# Altium project Project Kraken (The Ultimate ESP32-S3 dev board).PrjPcb (part 4 of 5)

## Sheet CAN.SchDoc
size A3; SheetNumber: 8; SheetTotal: 9
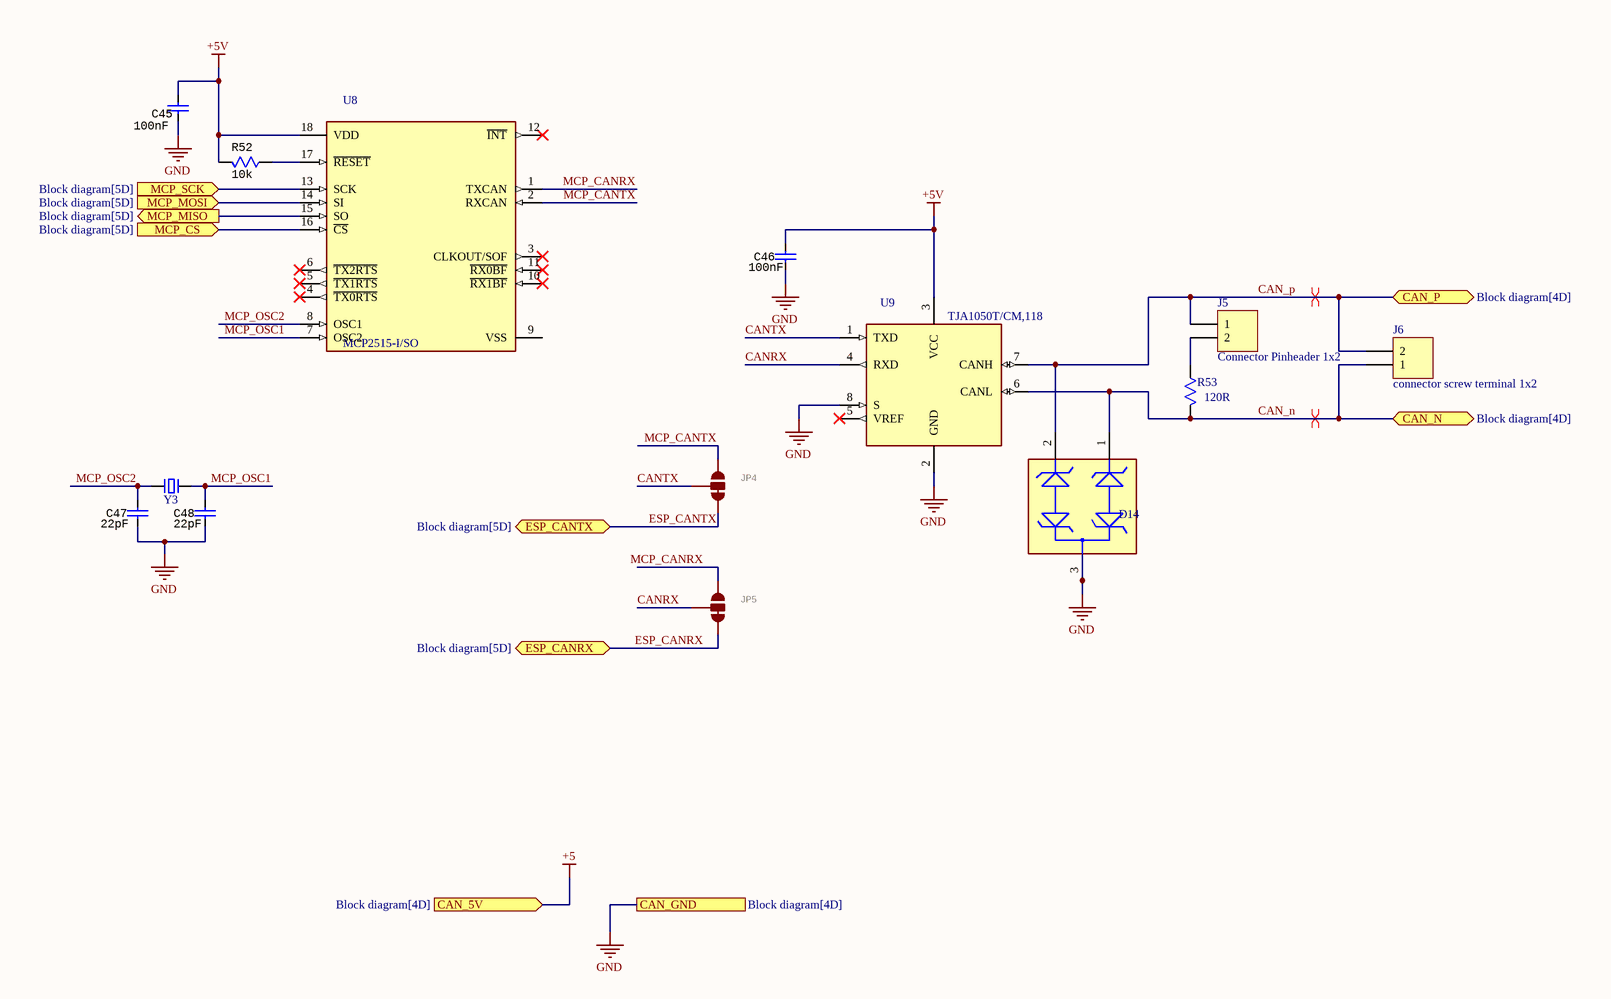
[diagram p6: CAN.SchDoc]

### Parts
C45  100nF  [CAP Ceramic SMD 0603]
C46  100nF  [CAP Ceramic SMD 0603]
C47  22pF  [CAP Ceramic SMD 0603]
C48  22pF  [CAP Ceramic SMD 0603]
D14  CPDT_12V  [SOT23]  (value not drawn)
J5  Connector Pinheader 1x2  [Header 1.27X2]
J6  connector screw terminal 1x2  [Connector screw terminal Block TH 1x2 3.5]
JP4  JUMPER-SMT_3_1-NC_TRACE_SILK  [SMT-JUMPER_3_1-NC_TRACE_SILK]  (value not drawn)
JP5  JUMPER-SMT_3_1-NC_TRACE_SILK  [SMT-JUMPER_3_1-NC_TRACE_SILK]  (value not drawn)
R52  value 10k  [RES SMD 0603]  (hidden comment: 10kR)
R53  120R  [RES SMD 0603]
U8  MCP2515-I/SO  [MCP2515]
U9  TJA1050T/CM,118  [TJA1050T/CM,118]
Y3  X49SD8MSD2SC  [Crystal TH 2-PIN HC-49S]  (value not drawn)

### Ports
CAN_5V (in, see Block diagram[4D]), CAN_GND (see Block diagram[4D]), CAN_N (bidir, see Block diagram[4D]), CAN_P (bidir, see Block diagram[4D]), ESP_CANRX (bidir, see Block diagram[5D]), ESP_CANTX (bidir, see Block diagram[5D]), MCP_CS (in, see Block diagram[5D]), MCP_MISO (out, see Block diagram[5D]), MCP_MOSI (in, see Block diagram[5D]), MCP_SCK (in, see Block diagram[5D])

### Nets
+5: C45.2 C46.2 R52.2 U8.18(VDD) U9.3(VCC) ; port CAN_5V  [also labelled +5V]
GND: C45.1 C46.1 C47.1 C48.1 D14.3 U9.2(GND) U9.8(S) ; port CAN_GND
CAN_n: D14.1 J6.1 R53.2 U9.6(CANL) ; port CAN_N
CAN_p: D14.2 J5.1 J6.2 U9.7(CANH) ; port CAN_P
CANRX: JP5.2 U9.4(RXD)
CANTX: JP4.2 U9.1(TXD)
ESP_CANRX: JP5.3 ; port ESP_CANRX  [project net CAN_RX]
ESP_CANTX: JP4.3 ; port ESP_CANTX  [project net CAN_TX]
ETH_MISO: U8.15(SO) ; port MCP_MISO
ETH_MOSI: U8.14(SI) ; port MCP_MOSI
ETH_SCLK: U8.13(SCK) ; port MCP_SCK
IO46: U8.16(~{CS}) ; port MCP_CS
MCP_CANRX: JP5.1 U8.1(TXCAN)
MCP_CANTX: JP4.1 U8.2(RXCAN)
MCP_OSC1: C48.2 U8.7(OSC2) Y3.1
MCP_OSC2: C47.2 U8.8(OSC1) Y3.2
NetJ5_2: J5.2 R53.1
NetR52_1: R52.1 U8.17(~{RESET})

Not connected (* = marked no-connect by the designer): U8 3(CLKOUT/SOF)* 4(~{TX0RTS})* 5(~{TX1RTS})* 6(~{TX2RTS})* 9(VSS) 10(~{RX1BF})* 11(~{RX0BF})* 12(~{INT})*; U9 5(VREF)*

### Layout directives
differential pair: CAN_n, CAN_p

### Library data of the parts
C45 C46 = CAP 0603 100nF 50V: Multilayer Ceramic Capacitors MLCC Surface Mount 0603 0.1uF 50 Volts X7R 10%; Manufacturer: Murata; Manufacturer Part Number: GRM188R71H104KA93D; Voltage Rating (DC): 50V; Insulation Resistance: 10GR; Value: 100nF; Supplier 1: LCSC; RoHS: Yes; Category: Ceramic Capacitors; Stock 1: 3546650; Pricing 1: 50=0.00420, 500=0.00330, 1500=0.00290, 5000=0.00260, 25000=0.00250, 50000=0.00240 (USD); Mount: Surface Mount; Case/Package: 0603; Number of Pins: 2; Case Code (Imperial): 0603; Case Code (Metric): 1608; Dielectric Material: Ceramic; Material: Ceramic; Contact Plating: Tin,Matte; Min Operating Temperature: -55°C; Max Operating Temperature: 125°C; Capacitance: 100nF; Tolerance: 10%; Packaging: Tape and Reel; Dielectric: X7R; Termination: SMD/SMT; Package Quantity: 1; Voltage Rating: 50V; Length: 1.6mm; Width: 0.8mm; Height: 0.8mm; Depth: 0.8mm; Thickness: 0.035inch; Radiation Hardening: No; RoHS Compliant: Yes; REACH SVHC: No SVHC; Lead Free: Lead Free; ComponentLink1URL: https://datasheet.ciiva.com/19467/1857604-19467681.pdf?src-supplier=Jameco; ComponentLink1Description: https://datasheet.ciiva.com/19467/1857604-19467681.pdf?src-supplier=Jameco; ComponentLink2URL: https://datasheet.ciiva.com/11786/0900766b807a1cab-11786047.pdf?src-supplier=RSComponents; ComponentLink2Description: https://datasheet.ciiva.com/11786/0900766b807a1cab-11786047.pdf?src-supplier=RSComponents; ComponentLink3URL: https://datasheet.ciiva.com/29201/451744-da-01-en-vs-kondensator-0603-29201904.pdf?src-supplier=Conrad; ComponentLink3Description: https://datasheet.ciiva.com/29201/451744-da-01-en-vs-kondensator-0603-29201904.pdf?src-supplier=Conrad; ComponentLink4URL: https://datasheet.ciiva.com/7937/4360-7937659.pdf?src-supplier=Element14; ComponentLink4Description: https://datasheet.ciiva.com/7937/4360-7937659.pdf?src-supplier=Element14; ComponentLink5URL: https://datasheet.ciiva.com/14116/nmgrm-data-en-14116602.pdf?src-supplier=Distrelec; ComponentLink5Description: https://datasheet.ciiva.com/14116/nmgrm-data-en-14116602.pdf?src-supplier=Distrelec; ComponentLink6URL: https://datasheet.ciiva.com/48436/nmgrm-data-en-48436667.pdf?src-supplier=Distrelec; ComponentLink6Description: https://datasheet.ciiva.com/48436/nmgrm-data-en-48436667.pdf?src-supplier=Distrelec; ComponentLink7URL: https://datasheet.ciiva.com/28534/4360-28534245.pdf?src-supplier=Element14; ComponentLink7Description: https://datasheet.ciiva.com/28534/4360-28534245.pdf?src-supplier=Element14; ComponentLink8URL: https://datasheet.ciiva.com/131/partnumbering-e-01-131739.pdf?src-supplier=Digi-Key; ComponentLink8Description: https://datasheet.ciiva.com/131/partnumbering-e-01-131739.pdf?src-supplier=Digi-Key; ComponentLink9URL: https://datasheet.ciiva.com/131/partnumbering-e-01-131738.pdf?src-supplier=Digi-Key; ComponentLink9Description: https://datasheet.ciiva.com/131/partnumbering-e-01-131738.pdf?src-supplier=Digi-Key; ComponentLink10URL: https://datasheet.ciiva.com/131/partnumbering-e-01-131740.pdf?src-supplier=Digi-Key; ComponentLink10Description: https://datasheet.ciiva.com/131/partnumbering-e-01-131740.pdf?src-supplier=Digi-Key; ComponentLink11URL: https://datasheet.ciiva.com/7937/1747470-7937658.pdf?src-supplier=Element14; ComponentLink11Description: https://datasheet.ciiva.com/7937/1747470-7937658.pdf?src-supplier=Element14; Supplier Part Number 1: C77055; Voltage: 50V
C47 C48 = CAP 0603 22pF 50V: CAP CER 22PF 50V C0G/NP0 0603; Manufacturer: Samsung; Manufacturer Part Number: CL10C220JB81PNC; Tolerance: 5%; Dielectric: C0G; Temperature Coefficient: 300ppm/°C; Value: 22pF; Supplier 1: LCSC; RoHS: Yes; Category: Ceramic Capacitors; Stock 1: 8800; Pricing 1: 50=0.02060, 500=0.01690, 1500=0.01410, 5000=0.01190, 25000=0.01150, 50000=0.01130 (USD); Mount: Surface Mount; Case/Package: 0603; Case Code (Imperial): 0603; Case Code (Metric): 1608; Min Operating Temperature: -55°C; Max Operating Temperature: 125°C; Capacitance: 22pF; Packaging: Tape and Reel; Package Quantity: 1; Voltage Rating: 50V; Length: 1.6mm; Width: 0.031inch; Height: 0.8mm; Depth: 0.8mm; Thickness: 0.035inch; Radiation Hardening: No; RoHS Compliant: Yes; Lead Free: Lead Free; ComponentLink1URL: https://datasheet.ciiva.com/6293/tdkmlcccaprange-6293701.pdf?src-supplier=Digi-Key; ComponentLink1Description: https://datasheet.ciiva.com/6293/tdkmlcccaprange-6293701.pdf?src-supplier=Digi-Key; ComponentLink2URL: https://datasheet.ciiva.com/22694/1796654-22694102.pdf?src-supplier=Element14; ComponentLink2Description: https://datasheet.ciiva.com/22694/1796654-22694102.pdf?src-supplier=Element14; ComponentLink3URL: https://datasheet.ciiva.com/6293/tdkmlcccaprange-6293704.pdf?src-supplier=Digi-Key; ComponentLink3Description: https://datasheet.ciiva.com/6293/tdkmlcccaprange-6293704.pdf?src-supplier=Digi-Key; ComponentLink4URL: https://datasheet.ciiva.com/28576/1744655-28576921.pdf?src-supplier=Element14; ComponentLink4Description: https://datasheet.ciiva.com/28576/1744655-28576921.pdf?src-supplier=Element14; ComponentLink5URL: https://datasheet.ciiva.com/7975/1796654-7975034.pdf?src-supplier=Element14; ComponentLink5Description: https://datasheet.ciiva.com/7975/1796654-7975034.pdf?src-supplier=Element14; ComponentLink6URL: https://datasheet.ciiva.com/26946/getdatasheetpartid-741952-26946507.pdf?src-supplier=Verical; ComponentLink6Description: https://datasheet.ciiva.com/26946/getdatasheetpartid-741952-26946507.pdf?src-supplier=Verical; ComponentLink7URL: https://datasheet.ciiva.com/6293/tdkmlcccaprange-6293708.pdf?src-supplier=Digi-Key; ComponentLink7Description: https://datasheet.ciiva.com/6293/tdkmlcccaprange-6293708.pdf?src-supplier=Digi-Key; ComponentLink8URL: https://datasheet.ciiva.com/16395/cl10c220jb81pnc-16395896.pdf?src-supplier=Future+Electronics; ComponentLink8Description: https://datasheet.ciiva.com/16395/cl10c220jb81pnc-16395896.pdf?src-supplier=Future+Electronics; ComponentLink9URL: https://datasheet.ciiva.com/15195/getdatasheetpartid-500209-15195809.pdf?src-supplier=Verical; ComponentLink9Description: https://datasheet.ciiva.com/15195/getdatasheetpartid-500209-15195809.pdf?src-supplier=Verical; Supplier Part Number 1: C170132; Voltage: 50V; Series: CL; Ratings: AEC-Q200; Supplier 2: LCSC; Supplier Part Number 2: C1653
D14 = CPDT_12V: TVS DIODE SOT23-3 (CAN TVS); Manufacturer: Bourns Inc.; Manufacturer Part Number: CDSOT23-SM712; Package: SOT23; ComponentLink2URL: https://www.bourns.com/docs/Product-Datasheets/CDSOT23-SM712.pdf; ComponentLink2Description: Datasheet
J5 = Connector Pinheader 1x2: Header_2x1
J6 = connector screw terminal 1x2: 691214110002 - Wire-To-Board Terminal Block, 3.5 mm, 2 Positions, 24 AWG, 16 AWG, 1.5 mm², Screw; Manufacturer: Wurth Electronics; Plating: Brass,Steel; Number of Levels: 1; Number of Positions Per Level: 2; Current: 10A; Voltage: 300V; Wire Gauge (Max): 24AWG; Wire Gauge (Min): 16AWG; Pitch: 0.138inch; Stripping Length: -6mm; Supplier 1: Digi-Key; Manufacturer Part Number: 691214110002; RoHS: Yes; Category: Terminal Blocks; Stock 1: 5949; Pricing 1: 1=0.83000, 10=0.73900, 50=0.63800, 100=0.57100, 500=0.53800, 1400=0.50400 (USD); Mount: Through Hole; Color: Blue,Green; Housing Material: PA66; Contact Material: Brass; Contact Plating: Brass,Tin; Min Operating Temperature: -40°C; Max Operating Temperature: 105°C; Packaging: Bulk; Termination: Screw; Package Quantity: 1400; Number of Contacts: 2; Series: WR-TBL Series 2141; Voltage Rating: 300V; Current Rating: 10A; Length: 7.4mm; Width: 7.9mm; Height: 12.2mm; Wire/Cable Gauge: 24AWG; REACH SVHC: Unknown; RoHS Compliant: Yes; ComponentLink1URL: https://datasheet.ciiva.com/824/6912141100xx-824001.pdf?src-supplier=Digi-Key; ComponentLink1Description: https://datasheet.ciiva.com/824/6912141100xx-824001.pdf?src-supplier=Digi-Key; ComponentLink2URL: https://datasheet.ciiva.com/48693/001088618-da-01-en-wr-tbl-terminal-block2141-691214110002-48693195.pdf?src-supplier=Conrad; ComponentLink2Description: https://datasheet.ciiva.com/48693/001088618-da-01-en-wr-tbl-terminal-block2141-691214110002-48693195.pdf?src-supplier=Conrad; Supplier Part Number 1: 732-2747-ND
JP4 JP5 = JUMPER-SMT_3_1-NC_TRACE_SILK: Normally closed trace jumper (1 of 2 connections)    This jumper has a trace between two pads so it's normally closed (NC). The other connection is normally open (NO). Use a razor knife to open the connection. For best results follow the IPC guidelines for cutting traces: Cutout at least 0.063 mm (0.005 in).  Remove all loose material to clean up the cut area.  Seal the cut with an approved epoxy.       Reapply solder to reclose the connection, or to close the NO connection.; GateName_1: G$1; SymbolName_1: SMT-JUMPER_3_1-NC_TRACE; DeviceName: _SILK; LibraryName: SparkFun-Jumpers; DeviceSetName: JUMPER-SMT_3_1-NC_TRACE; Package: SMT-JUMPER_3_1-NC_TRACE_SILK
R52 = RES 0603 10k 1%: Res Thick Film 0603 10K Ohm 1% 1/10W ±100ppm/°C Molded SMD Punched Carrier T/R; Manufacturer: Panasonic; Manufacturer Part Number: ERJ-3EKF1002V; Max Power Dissipation: 100mW; Voltage Rating: 75V; Tolerance: 1%; Supplier 1: LCSC; RoHS: Yes; Category: Chip SMD Resistors; Stock 1: 555600; Pricing 1: 50=0.010200, 500=0.008400, 1500=0.007300, 5000=0.006100, 25000=0.005500, 50000=0.005400 (AUD); Mount: Surface Mount; Case/Package: 0603; Number of Pins: 2; Case Code (Metric): 1608; Case Code (Imperial): 0603; Contact Plating: Tin; Size Code: 0603; Min Operating Temperature: -55°C; Max Operating Temperature: 155°C; Resistance: 10kR; Packaging: Tape and Reel; Resistor Type: Thick Film; Temperature Coefficient: 100ppm/°C; Number of Terminations: 2; Series: ERJ; Construction: Rectangular; Power Rating: 100mW; Features: Automotive AEC-Q200; Voltage Rating (DC): 75V; Package Quantity: 1; Resistance Tolerance: 1%; Termination: SMD/SMT; Technology: THICK FILM; Length: 1.6mm; Width: 0.031inch; Height: 0.45mm; Depth: 0.8mm; Radiation Hardening: No; RoHS Compliant: Yes; Military Standard: Not; Lead Free: Lead Free; REACH SVHC: No SVHC; ComponentLink1URL: https://datasheet.ciiva.com/7830/aoa0000ce2-7830729.pdf?src-supplier=Element14; ComponentLink1Description: https://datasheet.ciiva.com/7830/aoa0000ce2-7830729.pdf?src-supplier=Element14; ComponentLink2URL: https://datasheet.ciiva.com/46372/1678782-46372725.pdf?src-supplier=Element14; ComponentLink2Description: https://datasheet.ciiva.com/46372/1678782-46372725.pdf?src-supplier=Element14; ComponentLink3URL: https://datasheet.ciiva.com/28514/426256-28514198.pdf?src-supplier=Element14; ComponentLink3Description: https://datasheet.ciiva.com/28514/426256-28514198.pdf?src-supplier=Element14; ComponentLink4URL: https://datasheet.ciiva.com/24070/aoa0000ce2-24070318.pdf?src-supplier=Mouser; ComponentLink4Description: https://datasheet.ciiva.com/24070/aoa0000ce2-24070318.pdf?src-supplier=Mouser; ComponentLink5URL: https://datasheet.ciiva.com/16759/70260748-16759807.pdf?src-supplier=Allied+Electronics; ComponentLink5Description: https://datasheet.ciiva.com/16759/70260748-16759807.pdf?src-supplier=Allied+Electronics; ComponentLink6URL: https://datasheet.ciiva.com/9194/aoa0000ce2-9194199.pdf?src-supplier=Avnet; ComponentLink6Description: https://datasheet.ciiva.com/9194/aoa0000ce2-9194199.pdf?src-supplier=Avnet; ComponentLink7URL: https://datasheet.ciiva.com/48530/aoa0000ce2-48530988.pdf?src-supplier=Avnet; ComponentLink7Description: https://datasheet.ciiva.com/48530/aoa0000ce2-48530988.pdf?src-supplier=Avnet; ComponentLink8URL: https://datasheet.ciiva.com/30208/aoa0000ce2-30208985.pdf?src-supplier=Onlinecomponents.com; ComponentLink8Description: https://datasheet.ciiva.com/30208/aoa0000ce2-30208985.pdf?src-supplier=Onlinecomponents.com; Supplier Part Number 1: C191124
R53 = RES 0603 120R 1%: Res General Purpose Thick Film 0603 120 Ohm 1% 1/10W ±100ppm/°C Molded SMD Paper T/R; Manufacturer 1: Yageo; Manufacturer Part Number 1: RC0603FR-07120RL; Max Power Dissipation: 100mW; Voltage Rating: 50V; Tolerance: 1%; Supplier 1: Digi-Key; RoHS: Yes; Category: Chip SMD Resistors; Stock 1: 1785774; Pricing 1: 1=0.10000, 10=0.02100, 100=0.00870, 1000=0.00390, 2500=0.00339 (USD); Case/Package: 0603; Number of Pins: 2; Case Code (Metric): 1608; Case Code (Imperial): 0603; Min Operating Temperature: -55°C; Max Operating Temperature: 155°C; Resistance: 120R; Packaging: Tape and Reel; Resistor Type: Thick Film; Number of Terminations: 2; Temperature Coefficient: 100ppm/°C; Features: Moisture Resistant; Package Quantity: 1; Power Rating: 100mW; Termination: SMD/SMT; Voltage Rating (DC): 50V; Length: 1.6mm; Width: 0.031inch; Height: 0.022inch; Depth: 0.8mm; RoHS Compliant: Yes; Military Standard: Not; Lead Free: Lead Free; REACH SVHC: No SVHC; ComponentLink1URL: https://datasheet.ciiva.com/46395/443971-46395021.pdf?src-supplier=Element14; ComponentLink1Description: https://datasheet.ciiva.com/46395/443971-46395021.pdf?src-supplier=Element14; Supplier Part Number 1: 311-120HRCT-ND; ComponentLink2Description: https://datasheet.ciiva.com/2553/pyu-r-int-thick-7-2553513.pdf?src-supplier=Digi-Key; ComponentLink2URL: https://datasheet.ciiva.com/2553/pyu-r-int-thick-7-2553513.pdf?src-supplier=Digi-Key; ComponentLink3Description: https://datasheet.ciiva.com/2553/pyu-r-int-thick-7-2553514.pdf?src-supplier=Digi-Key; ComponentLink3URL: https://datasheet.ciiva.com/2553/pyu-r-int-thick-7-2553514.pdf?src-supplier=Digi-Key; ComponentLink4Description: https://datasheet.ciiva.com/2553/pyu-r-int-thick-7-2553512.pdf?src-supplier=Digi-Key; ComponentLink4URL: https://datasheet.ciiva.com/2553/pyu-r-int-thick-7-2553512.pdf?src-supplier=Digi-Key; ComponentLink5Description: https://datasheet.ciiva.com/7746/443971-7746249.pdf?src-supplier=Element14; ComponentLink5URL: https://datasheet.ciiva.com/7746/443971-7746249.pdf?src-supplier=Element14; ComponentLink6Description: https://datasheet.ciiva.com/7746/443971-7746248.pdf?src-supplier=Element14; ComponentLink6URL: https://datasheet.ciiva.com/7746/443971-7746248.pdf?src-supplier=Element14; Construction: Rectangular; Resistance Tolerance: 1%; Series: RC; Size Code: 0603
U8 = MCP2515-I/SO: IC CAN CONTROLLER W/SPI 18SOIC; Manufacturer: Microchip; Min Supply Voltage: 2.7V; Max Supply Voltage: 5.5V; Standoff Height: 0.1mm; Nominal Supply Current: 10mA; Interface: SPI,CAN; Part Number: MCP2515-I/SO; Lead Free: Yes; RoHS: TRUE; ComponentLink2URL: http://ww1.microchip.com/downloads/en/DeviceDoc/MCP2515-Stand-Alone-CAN-Controller-with-SPI-20001801J.pdf; Package: C04-051; Function: Controller; Link: https://octopart.com/mcp2515-i%2Fso-microchip-430187; Temperature: -40°C to +85°C; Ipc Land Pattern Name: SOIC127P1030X265-18; Ambient Temperature Range Low: -65°C; Height: 2.65mm; Ambient Temperature Range High: +125°C; Temperature Range Low: -40°C; Temperature Range High: +85°C; ComponentLink2Description: Datasheet
U9 = TJA1050T/CM,118: 1/1 Transceiver Half CANbus 8-SO; Manufacturer: NXP USA; Part Number: TJA1050T/CM,118; Link: https://www.snapeda.com/parts/TJA1050T/CM,118/NXP%20USA%20Inc./view-part/304529/?ref=snap; Purchase-URL: https://pricing.snapeda.com/search/part/TJA1050T/CM,118/?ref=eda; Package: SO-8 NXP Semiconductors
Y3 = X49SD8MSD2SC: 8MHz 49S Crystals 20pF ±20ppm ±30ppm -20℃~+70℃ HC-49S Crystals ROHS; Part Number: *; Manufacturer: *; Supplier: *; Supplier Part Number: *; Value: *; Supplier 1: LCSC; Supplier Part Number 1: C21263; Manufacturer Part Number: X49SD8MSD2SC; RoHS: No; Stock 1: 118995; Pricing 1: 5=0.07050, 50=0.05680, 150=0.04990, 500=0.04480, 2500=0.04070, 5000=0.03870 (USD)

## Sheet USB to UART0 interface.SchDoc
size A3; SheetNumber: 2; SheetTotal: 9
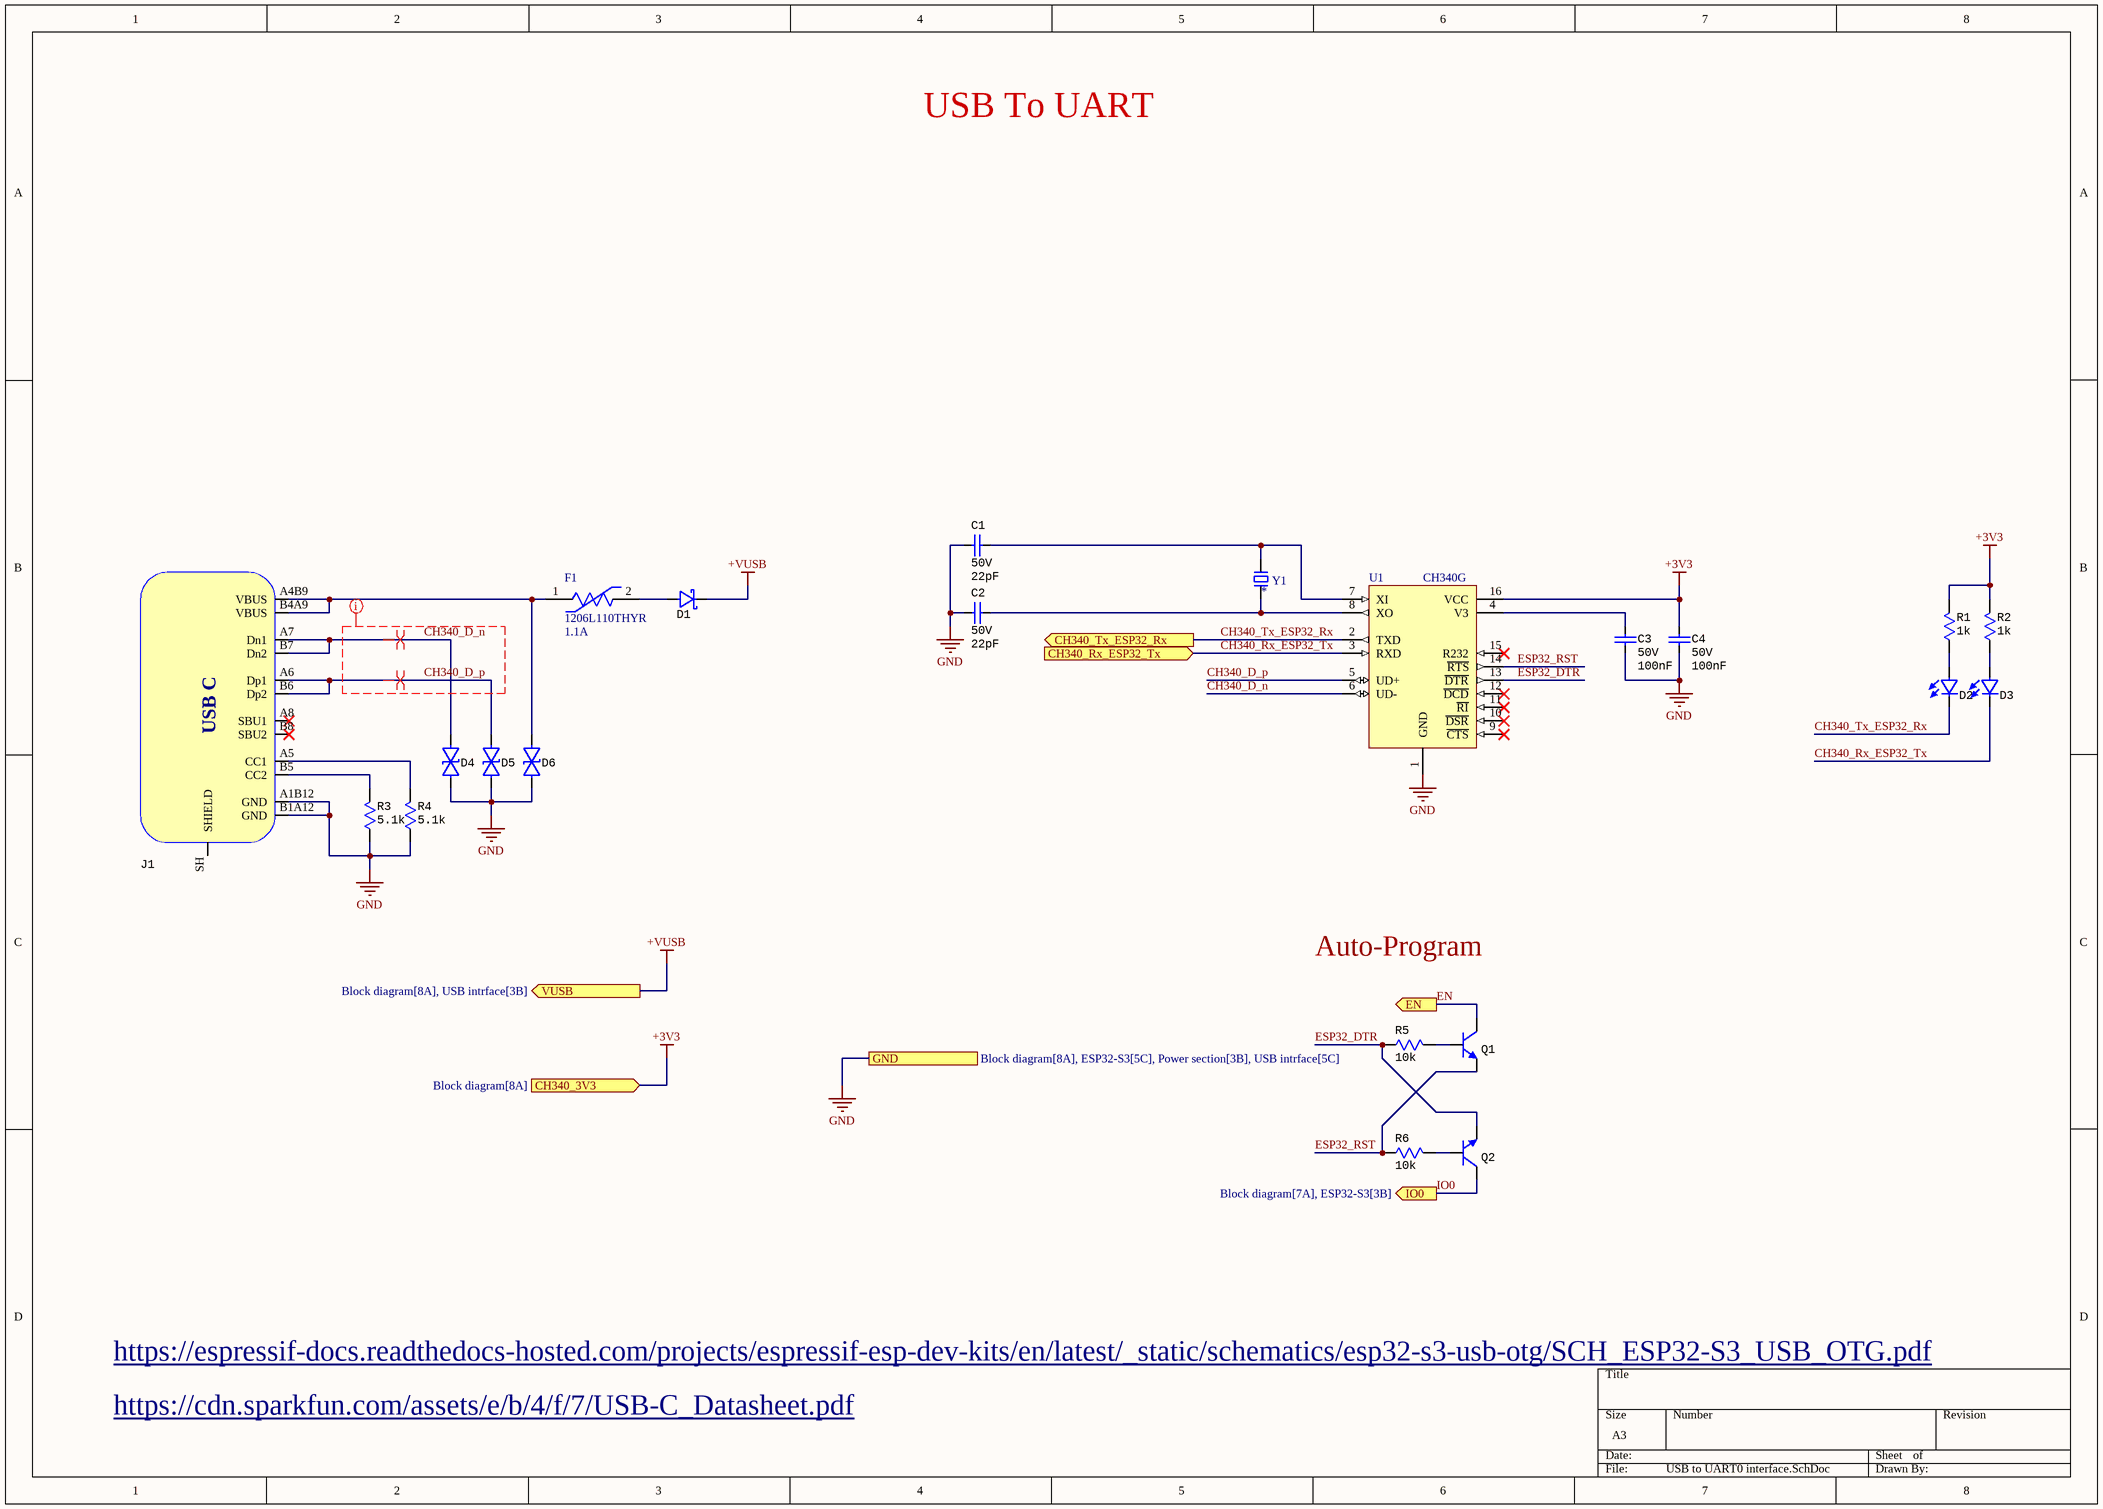
[diagram p7: USB to UART0 interface.SchDoc]

### Parts
C1  Voltage: 50V  [CAP Ceramic SMD 0603]  (hidden comment: 22pF)
C2  Voltage: 50V  [CAP Ceramic SMD 0603]  (hidden comment: 22pF)
C3  Voltage: 50V  [CAP Ceramic SMD 0603]  (hidden comment: 100nF)
C4  Voltage: 50V  [CAP Ceramic SMD 0603]  (hidden comment: 100nF)
D1  (no value)  [Diode Single SMD SOD123]
D2  (no value)  [LED SMD 0805G]
D3  (no value)  [LED SMD 0805G]
D4  (no value)  [Diode Single SMD SOD523]
D5  (no value)  [Diode Single SMD SOD523]
D6  (no value)  [Diode Single SMD SOD523]
F1  1206L110THYR  Hold Current: 1.1A  [FUSE-1206]
J1  Connector_USB_Type_C_12Pin  [USB-C-31-M-12 (12PIN)]  (value not drawn)
Q1  (no value)  [SOT23]
Q2  (no value)  [SOT23]
R1  value 1k  [RES SMD 0603]  (hidden comment: 1kR)
R2  value 1k  [RES SMD 0603]  (hidden comment: 1kR)
R3  value 5.1k  [RES SMD 0603]  (hidden comment: 5.1kR)
R4  value 5.1k  [RES SMD 0603]  (hidden comment: 5.1kR)
R5  value 10k  [RES SMD 0603]  (hidden comment: 10kR)
R6  value 10k  [RES SMD 0603]  (hidden comment: 10kR)
U1  CH340G  [CH340G]
Y1  X49SD8MSD2SC  [Crystal TH 2-PIN HC-49S]  (value not drawn)

### Ports
CH340_3V3 (in, see Block diagram[8A]), CH340_Rx_ESP32_Tx (in, see Block diagram[7A], ESP32-S3[3B]), CH340_Tx_ESP32_Rx (out, see Block diagram[7A], ESP32-S3[3A]), EN (out, see Block diagram[7A], ESP32-S3[3A]), GND (see Block diagram[8A], ESP32-S3[5C], Power section[3B], USB intrface[5C]), IO0 (out, see Block diagram[7A], ESP32-S3[3B]), VUSB (out, see Block diagram[8A], USB intrface[3B])

### Nets
+3V3: C4.1 R1.2 R2.2 U1.16(VCC) ; port CH340_3V3
+VUSB: D1.2 ; port VUSB  [project net +5]
GND: C1.1 C2.2 C3.2 C4.2 D4.1 D5.1 D6.1 J1.A1B12(GND) J1.B1A12(GND) R3.1 R4.1 U1.1(GND) ; port GND
CH340_D_n: D4.2 J1.A7(Dn1) J1.B7(Dn2) U1.6(UD-)
CH340_D_p: D5.2 J1.A6(Dp1) J1.B6(Dp2) U1.5(UD+)
CH340_Rx_ESP32_Tx: D3.2 U1.3(RXD) ; port CH340_Rx_ESP32_Tx
CH340_Tx_ESP32_Rx: D2.2 U1.2(TXD) ; port CH340_Tx_ESP32_Rx
EN: Q1.3(C) ; port EN
ESP32_DTR: Q2.2(E) R5.1 U1.13(~{DTR})
ESP32_RST: Q1.2(E) R6.1 U1.14(~{RTS})
IO0: Q2.3(C) ; port IO0
NetC1_2: C1.2 U1.7(XI) Y1.1
NetC2_1: C2.1 U1.8(XO) Y1.2
NetC3_1: C3.1 U1.4(V3)
NetD1_1: D1.1 F1.2
NetD2_1: D2.1 R1.1
NetD3_1: D3.1 R2.1
NetD6_2: D6.2 F1.1 J1.A4B9(VBUS) J1.B4A9(VBUS)
NetJ1_A5: J1.A5(CC1) R4.2
NetJ1_B5: J1.B5(CC2) R3.2
NetQ1_1: Q1.1(B) R5.2
NetQ2_1: Q2.1(B) R6.2

Not connected (* = marked no-connect by the designer): J1 A8(SBU1)* B8(SBU2)* SH(SHIELD); U1 9(~{CTS})* 10(~{DSR})* 11(~{RI})* 12(~{DCD})* 15(R232)*

### Layout directives
net class Diff90Ohm: CH340_D_n, CH340_D_p
differential pair: CH340_D_n, CH340_D_p

### Notes on the sheet
- USB To UART
- Auto-Program
- https://espressif-docs.readthedocs-hosted.com/projects/espressif-esp-dev-kits/en/latest/_static/schematics/esp32-s3-usb-otg/SCH_ESP32-S3_USB_OTG.pdf
- https://cdn.sparkfun.com/assets/e/b/4/f/7/USB-C_Datasheet.pdf
- (in symbol Connector_USB_Type_C_12Pin) USB C

### Library data of the parts
C1 C2 = CAP 0603 22pF 50V: as C47 on sheet CAN; ComponentLink1URL: https://datasheet.ciiva.com/6293/tdkmlcccaprange-6293701.pdf?src-supplier=Digi-Key; ComponentLink1Description: https://datasheet.ciiva.com/6293/tdkmlcccaprange-6293701.pdf?src-supplier=Digi-Key; ComponentLink2URL: https://datasheet.ciiva.com/22694/1796654-22694102.pdf?src-supplier=Element14; ComponentLink2Description: https://datasheet.ciiva.com/22694/1796654-22694102.pdf?src-supplier=Element14; ComponentLink3URL: https://datasheet.ciiva.com/6293/tdkmlcccaprange-6293704.pdf?src-supplier=Digi-Key; ComponentLink3Description: https://datasheet.ciiva.com/6293/tdkmlcccaprange-6293704.pdf?src-supplier=Digi-Key; ComponentLink4URL: https://datasheet.ciiva.com/28576/1744655-28576921.pdf?src-supplier=Element14; ComponentLink4Description: https://datasheet.ciiva.com/28576/1744655-28576921.pdf?src-supplier=Element14; ComponentLink5URL: https://datasheet.ciiva.com/7975/1796654-7975034.pdf?src-supplier=Element14; ComponentLink5Description: https://datasheet.ciiva.com/7975/1796654-7975034.pdf?src-supplier=Element14; ComponentLink6URL: https://datasheet.ciiva.com/26946/getdatasheetpartid-741952-26946507.pdf?src-supplier=Verical; ComponentLink6Description: https://datasheet.ciiva.com/26946/getdatasheetpartid-741952-26946507.pdf?src-supplier=Verical; ComponentLink7URL: https://datasheet.ciiva.com/6293/tdkmlcccaprange-6293708.pdf?src-supplier=Digi-Key; ComponentLink7Description: https://datasheet.ciiva.com/6293/tdkmlcccaprange-6293708.pdf?src-supplier=Digi-Key; ComponentLink8URL: https://datasheet.ciiva.com/16395/cl10c220jb81pnc-16395896.pdf?src-supplier=Future+Electronics; ComponentLink8Description: https://datasheet.ciiva.com/16395/cl10c220jb81pnc-16395896.pdf?src-supplier=Future+Electronics; ComponentLink9URL: https://datasheet.ciiva.com/15195/getdatasheetpartid-500209-15195809.pdf?src-supplier=Verical; ComponentLink9Description: https://datasheet.ciiva.com/15195/getdatasheetpartid-500209-15195809.pdf?src-supplier=Verical; Supplier 1: LCSC; RoHS: Yes; Category: Ceramic Capacitors; Stock 1: 8800; Pricing 1: 50=0.02060, 500=0.01690, 1500=0.01410, 5000=0.01190, 25000=0.01150, 50000=0.01130 (USD); Mount: Surface Mount; Case/Package: 0603; Case Code (Metric): 1608; Case Code (Imperial): 0603; Min Operating Temperature: -55°C; Max Operating Temperature: 125°C; Package Quantity: 1; Packaging: Tape and Reel; Capacitance: 22pF; Voltage Rating: 50V; Series: CL; Length: 1.6mm; Width: 0.031inch; Height: 0.8mm; Depth: 0.8mm; Thickness: 0.035inch; Ratings: AEC-Q200; Radiation Hardening: No; RoHS Compliant: Yes; Lead Free: Lead Free; Supplier Part Number 1: C170132; Supplier 2: LCSC; Supplier Part Number 2: C1653; Value: 22pF
C3 C4 = CAP 0603 100nF 50V: Multilayer Ceramic Capacitors MLCC Surface Mount 0603 0.1uF 50 Volts X7R 10%; Manufacturer: Murata; Manufacturer Part Number: GRM188R71H104KA93D; Insulation Resistance: 10GR; Supplier 1: LCSC; RoHS: Yes; Category: Ceramic Capacitors; Stock 1: 3546650; Pricing 1: 50=0.00420, 500=0.00330, 1500=0.00290, 5000=0.00260, 25000=0.00250, 50000=0.00240 (USD); Mount: Surface Mount; Case/Package: 0603; Number of Pins: 2; Case Code (Imperial): 0603; Case Code (Metric): 1608; Dielectric Material: Ceramic; Material: Ceramic; Contact Plating: Tin,Matte; Min Operating Temperature: -55°C; Max Operating Temperature: 125°C; Capacitance: 100nF; Tolerance: 10%; Packaging: Tape and Reel; Dielectric: X7R; Voltage Rating (DC): 50V; Termination: SMD/SMT; Package Quantity: 1; Voltage Rating: 50V; Length: 1.6mm; Width: 0.8mm; Height: 0.8mm; Depth: 0.8mm; Thickness: 0.035inch; Radiation Hardening: No; RoHS Compliant: Yes; REACH SVHC: No SVHC; Lead Free: Lead Free; ComponentLink1URL: https://datasheet.ciiva.com/19467/1857604-19467681.pdf?src-supplier=Jameco; ComponentLink1Description: https://datasheet.ciiva.com/19467/1857604-19467681.pdf?src-supplier=Jameco; ComponentLink2URL: https://datasheet.ciiva.com/11786/0900766b807a1cab-11786047.pdf?src-supplier=RSComponents; ComponentLink2Description: https://datasheet.ciiva.com/11786/0900766b807a1cab-11786047.pdf?src-supplier=RSComponents; ComponentLink3URL: https://datasheet.ciiva.com/29201/451744-da-01-en-vs-kondensator-0603-29201904.pdf?src-supplier=Conrad; ComponentLink3Description: https://datasheet.ciiva.com/29201/451744-da-01-en-vs-kondensator-0603-29201904.pdf?src-supplier=Conrad; ComponentLink4URL: https://datasheet.ciiva.com/7937/4360-7937659.pdf?src-supplier=Element14; ComponentLink4Description: https://datasheet.ciiva.com/7937/4360-7937659.pdf?src-supplier=Element14; ComponentLink5URL: https://datasheet.ciiva.com/14116/nmgrm-data-en-14116602.pdf?src-supplier=Distrelec; ComponentLink5Description: https://datasheet.ciiva.com/14116/nmgrm-data-en-14116602.pdf?src-supplier=Distrelec; ComponentLink6URL: https://datasheet.ciiva.com/48436/nmgrm-data-en-48436667.pdf?src-supplier=Distrelec; ComponentLink6Description: https://datasheet.ciiva.com/48436/nmgrm-data-en-48436667.pdf?src-supplier=Distrelec; ComponentLink7URL: https://datasheet.ciiva.com/28534/4360-28534245.pdf?src-supplier=Element14; ComponentLink7Description: https://datasheet.ciiva.com/28534/4360-28534245.pdf?src-supplier=Element14; ComponentLink8URL: https://datasheet.ciiva.com/131/partnumbering-e-01-131739.pdf?src-supplier=Digi-Key; ComponentLink8Description: https://datasheet.ciiva.com/131/partnumbering-e-01-131739.pdf?src-supplier=Digi-Key; ComponentLink9URL: https://datasheet.ciiva.com/131/partnumbering-e-01-131738.pdf?src-supplier=Digi-Key; ComponentLink9Description: https://datasheet.ciiva.com/131/partnumbering-e-01-131738.pdf?src-supplier=Digi-Key; ComponentLink10URL: https://datasheet.ciiva.com/131/partnumbering-e-01-131740.pdf?src-supplier=Digi-Key; ComponentLink10Description: https://datasheet.ciiva.com/131/partnumbering-e-01-131740.pdf?src-supplier=Digi-Key; ComponentLink11URL: https://datasheet.ciiva.com/7937/1747470-7937658.pdf?src-supplier=Element14; ComponentLink11Description: https://datasheet.ciiva.com/7937/1747470-7937658.pdf?src-supplier=Element14; Supplier Part Number 1: C77055; Value: 100nF
D1 = B5819W: 40V 600mV@1A 1A SOD-123 Schottky Barrier Diodes (SBD) ROHS; Manufacturer: MCC; Manufacturer Part Number: B5819W-TP; Element Configuration: Single; Forward Voltage: 550mV; Max Reverse Voltage (DC): 20V; Max Forward Surge Current (Ifsm): 10A; Max Reverse Current: 1mA; Max Power Dissipation: 250mW; Supplier 1: LCSC; RoHS: Yes; Category: Rectifier Diodes; Stock 1: 8570; Pricing 1: 10=0.04150, 100=0.03440, 300=0.03090, 3000=0.02820, 6000=0.02610, 9000=0.02500 (USD); Mount: Surface Mount; Min Operating Temperature: -65°C; Max Operating Temperature: 125°C; Package Quantity: 3000; Packaging: Tape and Reel; Average Rectified Current: 1A; Series: -; Reverse Voltage (DC): 40V; Forward Current: 1A; Max Repetitive Reverse Voltage (Vrrm): 40V; RoHS Compliant: Yes; ComponentLink1URL: https://datasheet.ciiva.com/6378/b5817w-b5819wsod-123-6378255.pdf?src-supplier=Digi-Key; ComponentLink1Description: https://datasheet.ciiva.com/6378/b5817w-b5819wsod-123-6378255.pdf?src-supplier=Digi-Key; Supplier Part Number 1: C84354
D2 D3 = LED 0805 Emerald: Manufacturer: FOSHAN Nationstar Optoelectronics; Manufacturer Part Number: NCD0805G1; Supplier 1: LCSC; Supplier Part Number 1: C84260; RoHS: No; Category: Uncategorized; Stock 1: 432460; Pricing 1: 20=0.01910, 200=0.01510, 600=0.01290, 3000=0.01160, 9000=0.01050, 21000=0.00990 (USD)
D4-D6 = LESD5D5.0CT1G: Bi-Directional 9.4A 5V 18.6V 5.6V SOD-523 ESD Protection Devices ROHS; Manufacturer: UMW(Youtai Semiconductor); Supplier 1: LCSC; Manufacturer Part Number: LESD5D5.0CT1G; RoHS: No; Category: Uncategorized; Stock 1: 13940; Pricing 1: 20=0.02140, 200=0.01710, 600=0.01470, 3000=0.01330, 9000=0.01330, 21000=0.01330 (USD); Supplier Part Number 1: C5199850
F1 = 1206L110THYR: PTC RESET FUSE 8V 1.1A 1206; Manufacturer: Littelfuse; Trip Time: 0.1s; Trip Current: 2.2A; Value: 0.04-0.21Ω; Current Rating: 100A; Voltage Rating: 8V; Device Class L3: unset; Manufacturer Part Number: 1206L110THYR; ComponentLink2URL: https://m.littelfuse.com/~/media/electronics/datasheets/resettable_ptcs/littelfuse_ptc_1206l_datasheet.pdf.pdf; Height: 0.6mm; Temperature Range Low: -40°C; Automotive: No; Device Class L2: PTC Resettable Fuses; Device Class L1: Circuit Protection; Digikey Description: PTC RESET FUSE 8V 1.1A 1206; Octopart: https://octopart.com/1206l110thyr-littelfuse-11800142; Temperature Range High: +85°C; Category: Fuse; RoHS: TRUE; Ambient Temperature Range Low: -40°C; Mouser Description: Resettable Fuses - PPTC PTC 8V 1206 1.1A POLYFUSE SMD THIN; ComponentLink2Description: Datasheet; Ambient Temperature Range High: +85°C; Lead Free: Yes; Resistance: 0.04-0.21Ω; Temperature: -40°C to +85°C; Package: 1206L
J1 = Connector_USB_Type_C_12Pin: Korean Hroparts Elec / USB-Type-C / Num of contacts 16 / Surface Mount; ManufacturerPartNumber: TYPE-C-31-M-12; SuplierPartNumber: C165948; TypeConnector: USB Type C; CurrentMax: 3A; Manufacturer: Korean Hroparts; HelpURL: https://lcsc.com/product-detail/USB-Type-C_Korean-Hroparts-Elec-TYPE-C-31-M-12_C165948.html
Q1 Q2 = BC817: NPN Ic=500mA Vceo=45V hfe=100~250 P=225mW SOT-23; Manufacturer: ON Semiconductor; Manufacturer Part Number: BC817-16LT1G; Collector Emitter Voltage (VCEO): 45V; Max Power Dissipation: 300mW; Max Collector Current: 500mA; Collector Base Voltage (VCBO): 50V; Emitter Base Voltage (VEBO): 5V; Collector Emitter Saturation Voltage: 700mV; Max Frequency: 100MHz; Element Configuration: Single; Number of Elements: 1; hFE Min: 100; Output Voltage: 15V; Supplier 1: LCSC; RoHS: Yes; Category: BJTs; Stock 1: 1880; Pricing 1: 10=0.03790, 100=0.03090, 300=0.02740, 3000=0.02460, 6000=0.02250, 9000=0.02140 (USD); Case/Package: SOT-23-3; Number of Pins: 3; Contact Plating: Tin,Matte; Weight: 0.001058oz; Min Operating Temperature: -55°C; Max Operating Temperature: 150°C; Packaging: Tape and Reel; Polarity: NPN; Power Dissipation: 300mW; Package Quantity: 3000; Frequency: 100MHz; Transition Frequency: 100MHz; Collector Emitter Breakdown Voltage: 45V; Max Breakdown Voltage: 45V; Gain Bandwidth Product: 100MHz; Collector-emitter Voltage-Max: 700mV; Series: -; Current Rating: 500mA; Voltage Rating (DC): 45V; Continuous Collector Current: 500mA; Length: 2.9mm; Width: 1.3mm; Height: 0.94mm; Radiation Hardening: No; RoHS Compliant: Yes; Lead Free: Lead Free; Reach SVHC Compliant: Yes; Halogen Free: Halogen Free; Supplier Part Number 1: C94373
R1 R2 = RES 0603 1k 1%: Res Thick Film 0603 1K Ohm 1% 1/10W ±100ppm/°C Molded SMD Punched Carrier T/R; Manufacturer: Panasonic; Manufacturer Part Number: ERJ3EKF1001V; Power Rating: 100mW; Voltage Rating: 75V; Supplier 1: LCSC; RoHS: Yes; Category: Chip SMD Resistors; Stock 1: 79650; Pricing 1: 50=0.009600, 500=0.008100, 1500=0.007300, 5000=0.006800, 25000=0.006400, 50000=0.006200 (AUD); Mount: Surface Mount; Case/Package: 0603; Number of Pins: 2; Case Code (Metric): 1608; Case Code (Imperial): 0603; Contact Plating: Tin; Size Code: 0603; Min Operating Temperature: -55°C; Max Operating Temperature: 155°C; Packaging: Tape and Reel; Resistance: 1kR; Resistor Type: Thick Film; Temperature Coefficient: 100ppm/°C; Series: ERJ; Tolerance: 1%; Number of Terminations: 2; Max Power Dissipation: 100mW; Construction: Rectangular; Features: Automotive AEC-Q200; Package Quantity: 5000; Termination: SMD/SMT; Voltage Rating (DC): 75V; Resistance Tolerance: 1%; Technology: THICK FILM; Length: 1.6mm; Width: 0.8mm; Height: 0.45mm; Depth: 0.8mm; Radiation Hardening: No; RoHS Compliant: Yes; Lead Free: Lead Free; Military Standard: Not; REACH SVHC: No SVHC; ComponentLink1URL: https://datasheet.ciiva.com/7942/aoa0000ce2-7942427.pdf?src-supplier=Element14; ComponentLink1Description: https://datasheet.ciiva.com/7942/aoa0000ce2-7942427.pdf?src-supplier=Element14; ComponentLink2URL: https://datasheet.ciiva.com/46373/1678782-46373340.pdf?src-supplier=Element14; ComponentLink2Description: https://datasheet.ciiva.com/46373/1678782-46373340.pdf?src-supplier=Element14; ComponentLink3URL: https://datasheet.ciiva.com/22673/1678782-22673918.pdf?src-supplier=Element14; ComponentLink3Description: https://datasheet.ciiva.com/22673/1678782-22673918.pdf?src-supplier=Element14; ComponentLink4URL: https://datasheet.ciiva.com/46373/1678782-46373339.pdf?src-supplier=Element14; ComponentLink4Description: https://datasheet.ciiva.com/46373/1678782-46373339.pdf?src-supplier=Element14; ComponentLink5URL: https://datasheet.ciiva.com/24070/aoa0000ce2-24070269.pdf?src-supplier=Mouser; ComponentLink5Description: https://datasheet.ciiva.com/24070/aoa0000ce2-24070269.pdf?src-supplier=Mouser; ComponentLink6URL: https://datasheet.ciiva.com/16768/70260748-16768437.pdf?src-supplier=Allied+Electronics; ComponentLink6Description: https://datasheet.ciiva.com/16768/70260748-16768437.pdf?src-supplier=Allied+Electronics; ComponentLink7URL: https://datasheet.ciiva.com/16774/70260748-16774550.pdf?src-supplier=Allied+Electronics; ComponentLink7Description: https://datasheet.ciiva.com/16774/70260748-16774550.pdf?src-supplier=Allied+Electronics; ComponentLink8URL: https://datasheet.ciiva.com/9198/aoa0000ce2-9198923.pdf?src-supplier=Avnet; ComponentLink8Description: https://datasheet.ciiva.com/9198/aoa0000ce2-9198923.pdf?src-supplier=Avnet; ComponentLink9URL: https://datasheet.ciiva.com/16449/aoa0000ce2-16449065.pdf?src-supplier=Future+Electronics; ComponentLink9Description: https://datasheet.ciiva.com/16449/aoa0000ce2-16449065.pdf?src-supplier=Future+Electronics; ComponentLink10URL: https://datasheet.ciiva.com/48530/aoa0000ce2-48530987.pdf?src-supplier=Avnet; ComponentLink10Description: https://datasheet.ciiva.com/48530/aoa0000ce2-48530987.pdf?src-supplier=Avnet; ComponentLink11URL: https://datasheet.ciiva.com/30063/aoa0000ce2-30063390.pdf?src-supplier=Onlinecomponents.com; ComponentLink11Description: https://datasheet.ciiva.com/30063/aoa0000ce2-30063390.pdf?src-supplier=Onlinecomponents.com; Supplier Part Number 1: C118155
R3 R4 = RES 0603 5.1k 1%: Res Thick Film 0603 5.1K Ohm 1% 1/10W ±100ppm/°C Molded SMD SMD Paper T/R; Manufacturer: Vishay; Manufacturer Part Number: CRCW06035K10FKEA; Max Power Dissipation: 100mW; Voltage Rating (DC): 75V; Supplier 1: LCSC; RoHS: Yes; Category: Chip SMD Resistors; Stock 1: 3800; Pricing 1: 50=0.017200, 500=0.013100, 1500=0.011300, 5000=0.010700, 25000=0.009300, 50000=0.009200 (AUD); Mount: Surface Mount; Case/Package: 0603; Case Code (Imperial): 0603; Case Code (Metric): 1608; Contact Plating: Tin; Size Code: 0603; Weight: 7.1E-05oz; Min Operating Temperature: -55°C; Max Operating Temperature: 155°C; Packaging: Tape and Reel; Resistance: 5.1kR; Tolerance: 1%; Temperature Coefficient: 100ppm/°C; Resistor Type: Thick Film; Series: CRCW; Number of Terminations: 2; Package Quantity: 5000; Power Rating: 100mW; Voltage Rating: 75V; Construction: Rectangular; Features: Automotive AEC-Q200; Termination: SMD/SMT; Resistance Tolerance: 1%; Technology: THICK FILM; Length: 1.55mm; Width: 0.85mm; Height: 0.45mm; Depth: 0.85mm; Radiation Hardening: No; RoHS Compliant: Yes; Lead Free: Lead Free; Military Standard: Not; REACH SVHC: Unknown; ComponentLink1URL: https://datasheet.ciiva.com/11809/0900766b80d98afc-11809935.pdf?src-supplier=RSComponents; ComponentLink1Description: https://datasheet.ciiva.com/11809/0900766b80d98afc-11809935.pdf?src-supplier=RSComponents; ComponentLink2URL: https://datasheet.ciiva.com/26314/fld-crcw-e3-data-en-26314742.pdf?src-supplier=Distrelec; ComponentLink2Description: https://datasheet.ciiva.com/26314/fld-crcw-e3-data-en-26314742.pdf?src-supplier=Distrelec; ComponentLink3URL: https://datasheet.ciiva.com/7690/1697337-7690728.pdf?src-supplier=Element14; ComponentLink3Description: https://datasheet.ciiva.com/7690/1697337-7690728.pdf?src-supplier=Element14; ComponentLink4URL: https://datasheet.ciiva.com/7690/1720486-7690873.pdf?src-supplier=Element14; ComponentLink4Description: https://datasheet.ciiva.com/7690/1720486-7690873.pdf?src-supplier=Element14; ComponentLink5URL: https://datasheet.ciiva.com/15159/getdatasheetpartid-32793-15159338.pdf?src-supplier=Verical; ComponentLink5Description: https://datasheet.ciiva.com/15159/getdatasheetpartid-32793-15159338.pdf?src-supplier=Verical; ComponentLink6URL: https://datasheet.ciiva.com/3257/dcrcwe3-3257758.pdf?src-supplier=Avnet; ComponentLink6Description: https://datasheet.ciiva.com/3257/dcrcwe3-3257758.pdf?src-supplier=Avnet; ComponentLink7URL: https://datasheet.ciiva.com/16226/dcrcwe3-16226862.pdf?src-supplier=Future+Electronics; ComponentLink7Description: https://datasheet.ciiva.com/16226/dcrcwe3-16226862.pdf?src-supplier=Future+Electronics; Supplier Part Number 1: C844933
R5 R6 = RES 0603 10k 1%: as R52 on sheet CAN; Supplier 1: LCSC; RoHS: Yes; Category: Chip SMD Resistors; Stock 1: 555600; Pricing 1: 50=0.010200, 500=0.008400, 1500=0.007300, 5000=0.006100, 25000=0.005500, 50000=0.005400 (AUD); Mount: Surface Mount; Case/Package: 0603; Number of Pins: 2; Case Code (Metric): 1608; Case Code (Imperial): 0603; Contact Plating: Tin; Size Code: 0603; Min Operating Temperature: -55°C; Max Operating Temperature: 155°C; Resistance: 10kR; Packaging: Tape and Reel; Resistor Type: Thick Film; Temperature Coefficient: 100ppm/°C; Tolerance: 1%; Number of Terminations: 2; Series: ERJ; Construction: Rectangular; Power Rating: 100mW; Features: Automotive AEC-Q200; Voltage Rating (DC): 75V; Package Quantity: 1; Resistance Tolerance: 1%; Termination: SMD/SMT; Technology: THICK FILM; Length: 1.6mm; Width: 0.031inch; Height: 0.45mm; Depth: 0.8mm; Radiation Hardening: No; RoHS Compliant: Yes; Military Standard: Not; Lead Free: Lead Free; REACH SVHC: No SVHC; ComponentLink1URL: https://datasheet.ciiva.com/7830/aoa0000ce2-7830729.pdf?src-supplier=Element14; ComponentLink1Description: https://datasheet.ciiva.com/7830/aoa0000ce2-7830729.pdf?src-supplier=Element14; ComponentLink2URL: https://datasheet.ciiva.com/46372/1678782-46372725.pdf?src-supplier=Element14; ComponentLink2Description: https://datasheet.ciiva.com/46372/1678782-46372725.pdf?src-supplier=Element14; ComponentLink3URL: https://datasheet.ciiva.com/28514/426256-28514198.pdf?src-supplier=Element14; ComponentLink3Description: https://datasheet.ciiva.com/28514/426256-28514198.pdf?src-supplier=Element14; ComponentLink4URL: https://datasheet.ciiva.com/24070/aoa0000ce2-24070318.pdf?src-supplier=Mouser; ComponentLink4Description: https://datasheet.ciiva.com/24070/aoa0000ce2-24070318.pdf?src-supplier=Mouser; ComponentLink5URL: https://datasheet.ciiva.com/16759/70260748-16759807.pdf?src-supplier=Allied+Electronics; ComponentLink5Description: https://datasheet.ciiva.com/16759/70260748-16759807.pdf?src-supplier=Allied+Electronics; ComponentLink6URL: https://datasheet.ciiva.com/9194/aoa0000ce2-9194199.pdf?src-supplier=Avnet; ComponentLink6Description: https://datasheet.ciiva.com/9194/aoa0000ce2-9194199.pdf?src-supplier=Avnet; ComponentLink7URL: https://datasheet.ciiva.com/48530/aoa0000ce2-48530988.pdf?src-supplier=Avnet; ComponentLink7Description: https://datasheet.ciiva.com/48530/aoa0000ce2-48530988.pdf?src-supplier=Avnet; ComponentLink8URL: https://datasheet.ciiva.com/30208/aoa0000ce2-30208985.pdf?src-supplier=Onlinecomponents.com; ComponentLink8Description: https://datasheet.ciiva.com/30208/aoa0000ce2-30208985.pdf?src-supplier=Onlinecomponents.com; Supplier Part Number 1: C191124
U1 = CH340G: Transceiver 2Mbps USB 2.0 SOP-16-150mil USB ICs ROHS; Manufacturer: WCH(Jiangsu Qin Heng); Part Numbr: CH340G; Supplier: LCSC; Supplier Part Number: C14267; ComponentLink1Description: link; ComponentLink1URL: https://www.lcsc.com/product-detail/USB-ICs_WCH-Jiangsu-Qin-Heng-CH340G_C14267.html
Y1 = X49SD8MSD2SC: as Y3 on sheet CAN; Part Number: *; Manufacturer: *; Supplier: *; Supplier Part Number: *; Value: *; Supplier 1: LCSC; Supplier Part Number 1: C21263; Manufacturer Part Number: X49SD8MSD2SC; RoHS: No; Stock 1: 118995; Pricing 1: 5=0.07050, 50=0.05680, 150=0.04990, 500=0.04480, 2500=0.04070, 5000=0.03870 (USD)